# EAGLE design source_eagle (EAGLE 9.6.2)
COMPANY: ADAFRUIT INDUSTRIES; DRAWN: KTOWN; REV: A
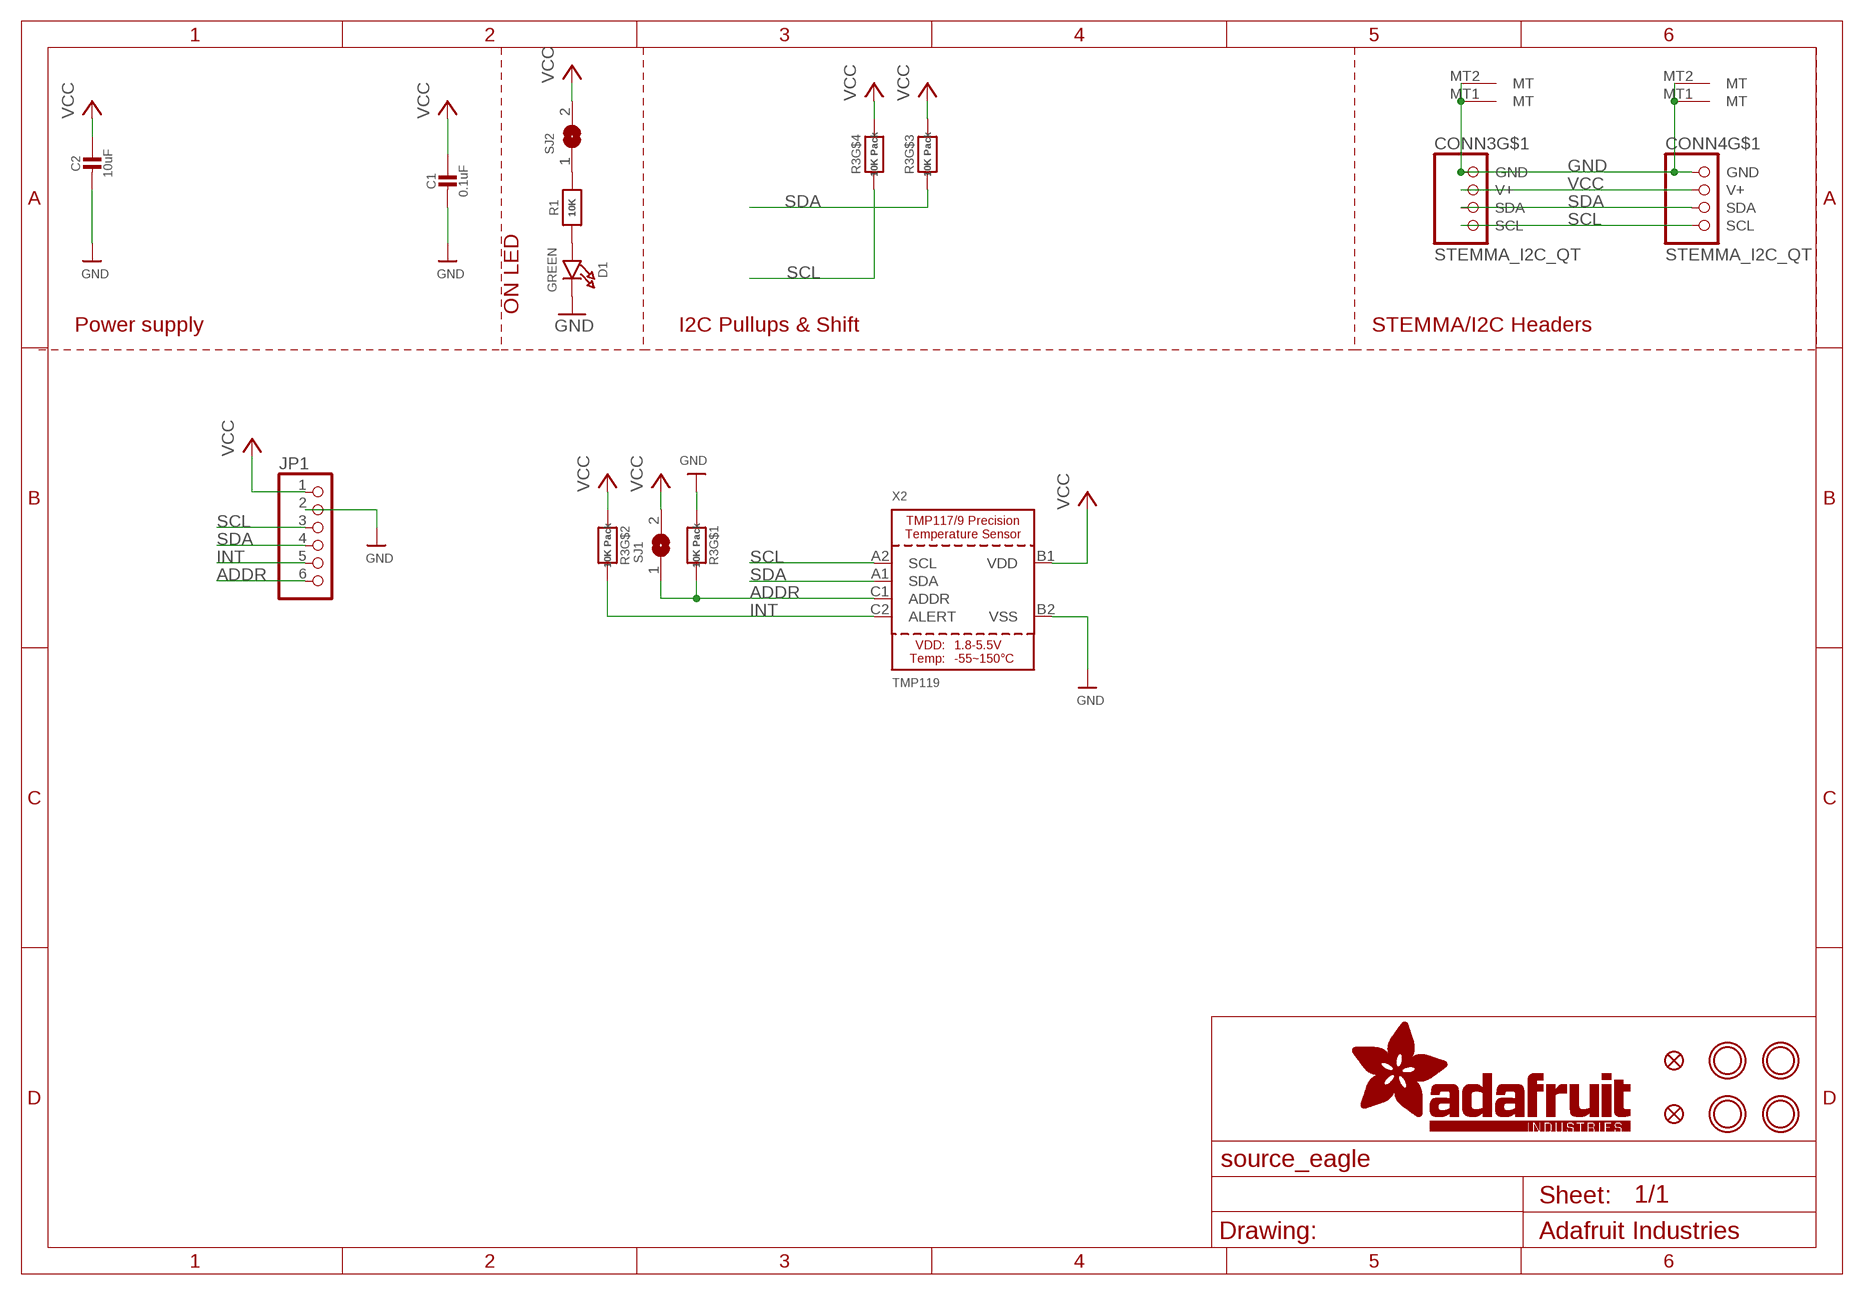
[diagram p0: schematic, sheet 1]

## Parts
C1  0.1uF  CAP_CERAMIC0603_NO  [0603-NO]
C2  10uF  CAP_CERAMIC0805-NOOUTLINE  [0805-NO]
CONN3  STEMMA_I2C_QT  [JST_SH4]
CONN4  STEMMA_I2C_QT  [JST_SH4]
D1  GREEN  LED0603_NOOUTLINE  [CHIPLED_0603_NOOUTLINE]
FID3  FIDUCIAL_0.5MM  [FIDUCIAL_0.5MM]
FID4  FIDUCIAL_0.5MM  [FIDUCIAL_0.5MM]
JP1  HEADER-1X670MIL  [1X06_ROUND_70]
R1  10K  RESISTOR_0603_NOOUT  [0603-NO]
R3  10K Pack  RESISTOR_4PACK  [RESPACK_4X0603]
SJ1  SOLDERJUMPER  [SOLDERJUMPER_ARROW_NOPASTE]
SJ2  SOLDERJUMPERCLOSED  [SOLDERJUMPER_CLOSEDWIRE]
U$1  MOUNTINGHOLE2.5  [MOUNTINGHOLE_2.5_PLATED]
U$17  MOUNTINGHOLE2.5  [MOUNTINGHOLE_2.5_PLATED]
U$19  MOUNTINGHOLE2.5  [MOUNTINGHOLE_2.5_PLATED]
U$21  MOUNTINGHOLE2.5  [MOUNTINGHOLE_2.5_PLATED]
X2  TMP119  [DSBGA-9]

## Nets
ADDR: JP1.6 R3.8 SJ1.1 X2.C1(ADDR)
GND [highpower]: C1.2 C2.2 CONN3.1(GND) CONN3.MT1(MT) CONN3.MT2(MT) CONN4.1(GND) CONN4.MT1(MT) CONN4.MT2(MT) D1.C JP1.2 R3.1 X2.B2(VSS)
INT: JP1.5 R3.7 X2.C2(ALERT)
N$1: D1.A R1.1
N$2 [highpower]: R1.2 SJ2.1
SCL: CONN3.4(SCL) CONN4.4(SCL) JP1.3 R3.4 X2.A2(SCL)
SDA: CONN3.3(SDA) CONN4.3(SDA) JP1.4 R3.3 X2.A1(SDA)
VCC [highpower]: C1.1 C2.1 CONN3.2(V+) CONN4.2(V+) JP1.1 R3.2 R3.5 R3.6 SJ1.2 SJ2.2 X2.B1(VDD)

## Notes on the sheet
- ON LED
- Power supply | I2C Pullups & Shift | STEMMA/I2C Headers

## Library data of the parts
C1 C2 = microbuilder:CAP_CERAMIC: Ceramic Capacitors For new designs, use the packages preceded by an '_' character since they are more reliable: The following footprints should be used on most boards: _0402 - Standard footprint for regular board layouts _0603 - Standard footprint for regular board layouts _0805 - Standard footprint for regular board layouts _1206 - Standard footprint for regular board layouts For extremely tight-pitch boards where space is at a premium, the following 'micro-pitch' footprints can be used (smaller pads, no silkscreen outline, etc.): _0402MP - Micro-pitch footprint for very dense/compact boards _0603MP - Micro-pitch footprint for very dense/compact boards _0805MP - Micro-pitch footprint for very dense/compact boards _1206MP - Micro-pitch footprint for very dense/compact boards
CONN3 CONN4 = adafruit_electromech:STEMMA_I2C; LCSC: C2845363
D1 = microbuilder:LED: LED 0603 - 0603 Surface Mount Package 2mA: Green LED - Low Power (3.9mcd, 2ma, 1.7Vf) - Digikey: 475-2709-2-ND Orange LED - Low Power (9.8mcd, 2ma, 1.8Vf) - Digikey: 475-1194-2-ND Red LED - Low Power (5mcd, 2ma, 1.8Vf) - Digikey: 475-1195-2-ND Yellow LED - Low Power (7mcd, 2ma, 1.8Vf) - Digikey: 475-1196-2-ND 5mA: Blue LED - Low Power (17mcd, 5ma, 2.9Vf) - Digikey: LNJ937W8CRACT-ND 0805 - 0805 Surface Mount Package 2mA: Red LED (8.8mcd, 2mA, 1.8Vf, Clear) - Low Power [Digikey: 475-2510-1-ND] Green LED (5mcd, 2mA, 1.8Vf, Clear) - Low Power [Digikey: 475-2730-1-ND] Yellow LED (11.3mcd, 2mA, 1.8Vf, Clear) - Low Power [Digikey: 475-2555-1-ND] 20mA: Red LED (104mcd, 20mA, Diffused) - LS R976 [Digikey: 475-1278-6-ND] Red LED (12mcd, 20mA, 2.0Vf, Clear) - APT2012EC [Digikey: 754-1128-1-ND] Green LED (15mcd, 20mA, 2.2Vf, Clear) - APT2012GC [Digikey: 754-1131-1-ND] Orange LED (160mcd, 20mA, 2.1Vf, Clear) - APT2012SECK [Digikey: 754-1130-1-ND] 1206 - 1206 Surface Mount Package Green LED (26mcd, 20mA, Diffused) - LG N971 [Digikey: 475-1407-6-ND] Red LED (15mcd, 20mA, Diffused) - LH N974 [Digikey: 475-1416-6-ND] Cree - Cree High-Power Surface Mount LEDs XPEBWT-L1-0000-00D50 - White 111lm 350mA 2.9Vf 6200K 110° XTEAWT-00-0000-00000LEE3 - White 114lm 350mA 2.85Vf 5000K 115° Everlight - Everlight 45-21 Series Surface Mount LEDs 45-21/QK2C-B2832AC2CB2/2T - Warm White 2000mcd 20mA 3.25Vf 3050K 120° 45-21/LK2C-B38452C4CB2/2T - Nuetral White 2000mcd 20mA 3.25Vf 4150K 120° 45-21/LK2C-B50634C6CB2/2T - Cold White 2200mcd 20mA 3.25Vf 5650K 120° PLCC2 Reverse Mount LS T77K-J1L2-1-0-2-R18-Z - Red 11.25mcd 2mA 1.8Vf 630nm 120° LO T77K-L1M2-24-Z - Orange 19.6mcd 2mA 1.8Vf 606nm 120° LY T77K-K2M1-26-Z - Yellow 15.7mcd 2mA 1.8Vf 587nm 120°; ROT: 270
FID3 FID4 = microbuilder:FIDUCIAL: Fiducial Alignment Points Various fiducial points for machine vision alignment.
JP1 = microbuilder:HEADER-1X6: PIN HEADER
R1 = microbuilder:RESISTOR: Resistors For new designs, use the packages preceded by an '_' character since they are more reliable: The following footprints should be used on most boards: _0402 - Standard footprint for regular board layouts _0603 - Standard footprint for regular board layouts _0805 - Standard footprint for regular board layouts _1206 - Standard footprint for regular board layouts For extremely tight-pitch boards where space is at a premium, the following 'micro-pitch' footprints can be used (smaller pads, no silkscreen outline, etc.): _0402MP - Micro-pitch footprint for very dense/compact boards _0603MP - Micro-pitch footprint for very dense/compact boards _0805MP - Micro-pitch footprint for very dense/compact boards _1206MP - Micro-pitch footprint for very dense/compact boards
R3 = microbuilder:RESISTOR_4PACK: Resistor Packs (4 resistors) 4 x 0603 10K 1/16W - Digikey: YC164J-10KCT-ND
SJ1 = microbuilder:SOLDERJUMPER: SMD Solder JUMPER Solder the two pads together to create a connection, or remove the solder to break it. REFLOW - Use this footprint for solder paste and reflow ovens. WAVE - Use this footprint for hand-soldering (larger pads). CLOSED - Has a trace between the two pads to ensure it is closed by default. The trace needs to be cut to disable the jumper, and can be closed again by creating a solder bridge between the two pads.; BOM: EXCLUDE
SJ2 = microbuilder:SOLDERJUMPER: SMD Solder JUMPER Solder the two pads together to create a connection, or remove the solder to break it. REFLOW - Use this footprint for solder paste and reflow ovens. WAVE - Use this footprint for hand-soldering (larger pads). CLOSED - Has a trace between the two pads to ensure it is closed by default. The trace needs to be cut to disable the jumper, and can be closed again by creating a solder bridge between the two pads.
U$1 U$17 U$19 U$21 = adafruit_electromech:MOUNTINGHOLE: Mounting Hole For #2 screws (0.086"/2.18mm width, 0.094"/2.4mm hole) use 2.5mm; BOM: EXCLUDE
X2 = adafruit_sensor:TMP119

## Net classes
1 highpower: width 0.305 mm, drill 0.483 mm
2 lowpower: width 0.254 mm, drill 0.483 mm

## Board
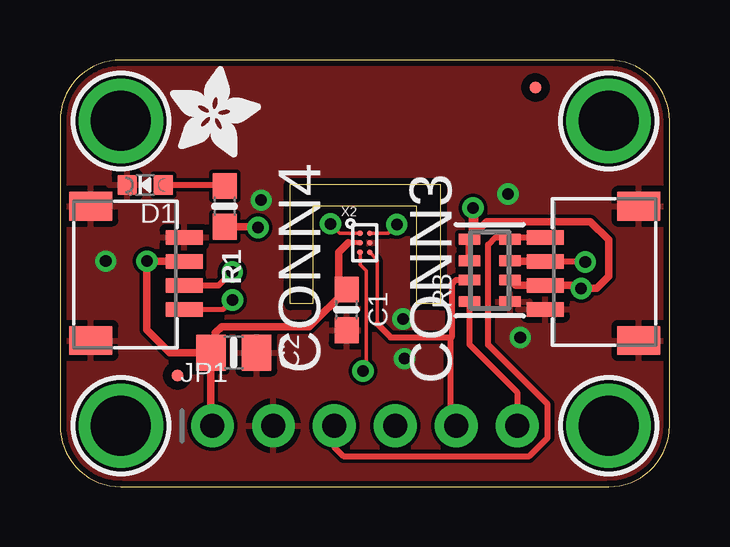
[diagram p1: board, top side]
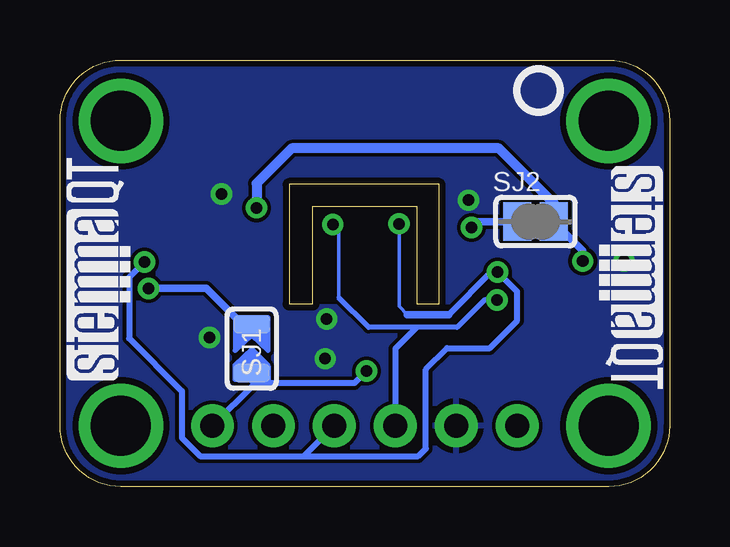
[diagram p2: board, bottom side, seen from below]

Size 25.4 x 17.78 mm. Coordinates in mm from the lower left corner, seen from the top.
Outline: 0,15.24 0,2.54 arc90 2.54,0 22.86,0 arc90 25.4,2.54 25.4,15.24 arc90 22.86,17.78 2.54,17.78 arc90 0,15.24
Outline: 9.6,7.62 9.6,12.6 15.85,12.6 15.85,7.62 14.86,7.62 14.86,11.68 10.54,11.68 10.54,7.62 9.6,7.62
Copper layers (1*16): Top 0.035mm / dielectric 1.5mm / Bottom 0.035mm
Design rules "adafruit 6-6": minimum track width 6mil, minimum drill 15.5mil, track to track 6mil, track to pad 6mil, pad to pad 6mil, via to via 6mil, smd to smd 6mil, copper to edge 10mil, drill to drill 8mil, minimum pad ring 10mil, minimum via ring 8mil, stop-mask expansion 2mil, vias tented up to drill 20mil, thermal gap 10mil
bRestrict: area 10.5,7.6 to 14.9,11.7

### Footprints (pad centres in the part's own frame; a part is rotated, then mirrored left to right if it is on the bottom)
0603-NO = smd 1.075 x 1: 1 -0.85,0; 2 0.85,0
0805-NO = smd 1.24 x 1.5: 1 -0.95,0; 2 0.95,0
JST_SH4 = smd 0.6 x 1.55: 1 -1.5,2.006; 2 -0.5,2.006; 3 0.5,2.006; 4 1.5,2.006 | smd 1.2 x 1.8: MT1 -2.8,-1.894; MT2 2.8,-1.894
CHIPLED_0603_NOOUTLINE = smd 0.8 x 0.8: A 0,-0.75; C 0,0.75
FIDUCIAL_0.5MM = smd 0.5 x 0.5: 1 0,0
1X06_ROUND_70 = drill 1 pad 1.778: 1 -6.35,0; 2 -3.81,0; 3 -1.27,0; 4 1.27,0; 5 3.81,0; 6 6.35,0
RESPACK_4X0603 = smd 0.45 x 0.9: 1 -1.3,-0.85; 2 -0.4,-0.85; 3 0.4,-0.85; 4 1.3,-0.85; 5 1.3,0.85; 6 0.4,0.85; 7 -0.4,0.85; 8 -1.3,0.85
SOLDERJUMPER_ARROW_NOPASTE = smd 0.762 x 1.524: 1 -1.016,0; 2 1.016,0
SOLDERJUMPER_CLOSEDWIRE = smd 1.168 x 1.6: 1 -0.762,0; 2 0.762,0 | smd 0.635 x 0.203: WIRE 0,0
MOUNTINGHOLE_2.5_PLATED = drill 2.5 pad 3.2: P$1 0,0
DSBGA-9 = smd 0.23 x 0.23: A1 -0.2,0.4; A2 0.2,0.4; B1 -0.2,0; B2 0.2,0; C1 -0.2,-0.4; C2 0.2,-0.4

### Placement (x,y rotation side)
C1  11.94,7.37 270 top
C2  7.24,5.59 0 top
CONN3  22.23,8.89 90 top
CONN4  3.17,8.89 270 top
D1  3.56,12.57 90 top
FID3  4.89,4.64 0 top
FID4  19.81,16.64 0 top
JP1  12.7,2.54 0 top
PLABEL0  [PLABEL0]  6.35,0.89 0 top
PLABEL1  [PLABEL1]  8.89,4.19 0 top
PLABEL2  [PLABEL2]  11.43,0.89 0 top
PLABEL3  [PLABEL3]  13.97,4.19 0 top
PLABEL4  [PLABEL4]  16.64,0.89 0 top
PLABEL5  [PLABEL5]  19.05,4.19 0 top
PLABEL6  [PLABEL6]  14.35,16.57 0 top
PLABEL7  [PLABEL7]  14.33,14.22 0 top
PLABEL8  [PLABEL8]  0.38,12.45 0 top
PLABEL9  [PLABEL9]  12.7,16.51 0 bottom
PLABEL10  [PLABEL10]  12.7,15.05 0 bottom
PLABEL11  [PLABEL11]  12.7,1.02 0 bottom
PLABEL12  [PLABEL12]  17.36,8.13 0 bottom
PLABEL13  [PLABEL13]  12.7,13.53 0 bottom
PLABEL14  [PLABEL14]  11.54,5.11 0 bottom
PLABEL15  [PLABEL15]  5.37,9.33 0 bottom
R1  6.86,11.68 270 top
R3  17.91,9.02 90 top
SJ1  17.41,5.75 90 bottom
SJ2  5.59,11.05 0 bottom
U$1  2.54,15.24 0 top
U$17  22.86,15.24 0 top
U$19  2.54,2.54 0 top
U$21  22.86,2.54 0 top
U$22  [ADAFRUIT_3.5MM]  4.57,13.72 0 top
U$25  [PCBFEAT-REV-040]  5.46,16.51 0 bottom
U$30  [STEMMAQT]  22.48,4.45 90 bottom
U$31  [STEMMAQT]  2.92,13.34 270 bottom
X2  12.7,10.16 0 top

### Tracks (layer width: path | path; a pad name or v marks a point on that pad's centre or on a via)
ADDR  (via drill 0.48)
  Top 0.152: X2.C1 12.5,9.25 12.76,8.99 12.76,4.96 v12.63,4.83
  Top 0.254: R3.8 17.06,5.93 19.05,3.94 JP1.6
  Bottom 0.254: v12.63,4.83 12.76,4.69 13.13,4.32 17.27,4.32 JP1.6
  Bottom 0.305: SJ1.1 17.41,4.46 17.27,4.32
GND  (via drill 0.48)
  other vias: 1.91,9.4 18.67,12.19 8.38,11.94 14.35,5.33 19.18,6.22 14.29,6.99
  pour Top: 0,17.78 25.4,17.78 25.4,0 0,0
  pour Bottom: 0,17.78 25.4,17.78 25.4,0 0,0
INT
  Top 0.152: X2.C2 13.21,9.45 13.21,6.79
  Top 0.254: R3.7 16.49,8.62 16.32,8.45 16.32,6.22 16.26,6.22 | 13.21,6.79 13.78,6.22 16.26,6.22 | 16.26,6.22 16.26,2.79 JP1.5
N$1
  Top 0.254: D1.A 6.82,12.57 R1.1
N$2  (via drill 0.48)
  Top 0.305: R1.2 8.22,10.83 v8.26,10.79
  Bottom 0.305: v8.26,10.79 8,11.05 SJ2.1
SCL  (via drill 0.48)
  Top 0.152: X2.A2 13.67,10.56 v14.03,10.92
  Top 0.203: CONN4.4 6.8,7.39 v7.19,7.79
  Top 0.254: JP1.3 11.43,1.65 11.81,1.27 19.56,1.27 20.32,2.03 20.32,3.43 17.84,5.91 17.84,10.09 18.14,10.39 18.76,10.39 CONN3.4
  Top 0.305: R3.4 18.76,10.39
  Bottom 0.152: v14.03,10.92 13.78,10.67 13.78,7.88
  Bottom 0.203: v7.19,7.79 7.71,7.79 8.85,6.64 10.54,6.64 12.54,6.64 13.78,7.88
  Bottom 0.254: 10.54,6.64 11.43,5.75 JP1.3
SDA  (via drill 0.48)
  Top 0.152: X2.A1 11.66,10.56 v11.27,10.95
  Top 0.254: v21.88,9.36 21.85,9.39 CONN3.3 | CONN4.3 6.61,8.39 v7.18,8.95
  Top 0.305: CONN3.3 18.78,9.39 R3.3
  Bottom 0.152: v11.27,10.95 11.27,7.53 10.92,7.18
  Bottom 0.254: JP1.4 15.24,1.27 | 15.24,1.27 19.56,1.27 20.32,2.03 20.32,3.98 22.52,6.18 22.52,8.72 v21.88,9.36 | 9.21,7.18 7.43,8.95 v7.18,8.95 6.35,8.13 6.35,6.92 7.49,5.78 9.27,5.78 10.16,4.89 10.16,1.59 10.48,1.27 15.24,1.27
  Bottom 0.305: 9.21,7.18 10.92,7.18
VCC  (via drill 0.48)
  Top 0.203: X2.B1 12,10.16
  Top 0.305: C2.1 6.29,5.79 6.48,5.98 6.48,6.41 6.73,6.67 10.39,6.67 C1.1 11.62,7.83 11.62,9.78 12,10.16 | C2.1 6.29,2.6 JP1.1 | R3.2 18.98,8.39 CONN3.2 21.59,8.39 v21.72,8.27 22.36,8.27 22.86,8.76 22.86,10.29 22.1,11.05 17.79,11.05 R3.5 R3.6 | CONN4.2 5.12,9.34 4.64,9.34 4.57,9.4 v3.62,9.4 3.62,6.54 4.57,5.59 C2.1
  Top 0.406: v17.21,11.62 17.21,10.47 R3.5
  Bottom 0.305: v21.72,8.27 19.3,8.27 17.81,6.77 SJ1.2 | v3.62,9.4 3.62,9.84 SJ2.2
  Bottom 0.406: SJ2.2 4.83,11.81 7.11,14.1 15.75,14.1 17.21,12.64 v17.21,11.62

### Text on the board
Pinguin_tBackup: TMP119 | Precision / Temperature Sensor | on | GND | SDA | ADDR | VIN | SCL | INT
Pinguin_bBackup: TMP119 | Temperature Sensor | ±0.03°C Typ. 0~45°C | LED | ADDR | Default I2C / addr 0x48 | VLogic/Vcc: 3-5VDC